# Altium schematic sheet Microcontroller.SchDoc: Microcontroller
size A3; DocumentNumber: 13; SheetNumber: 13; SheetTotal: 19
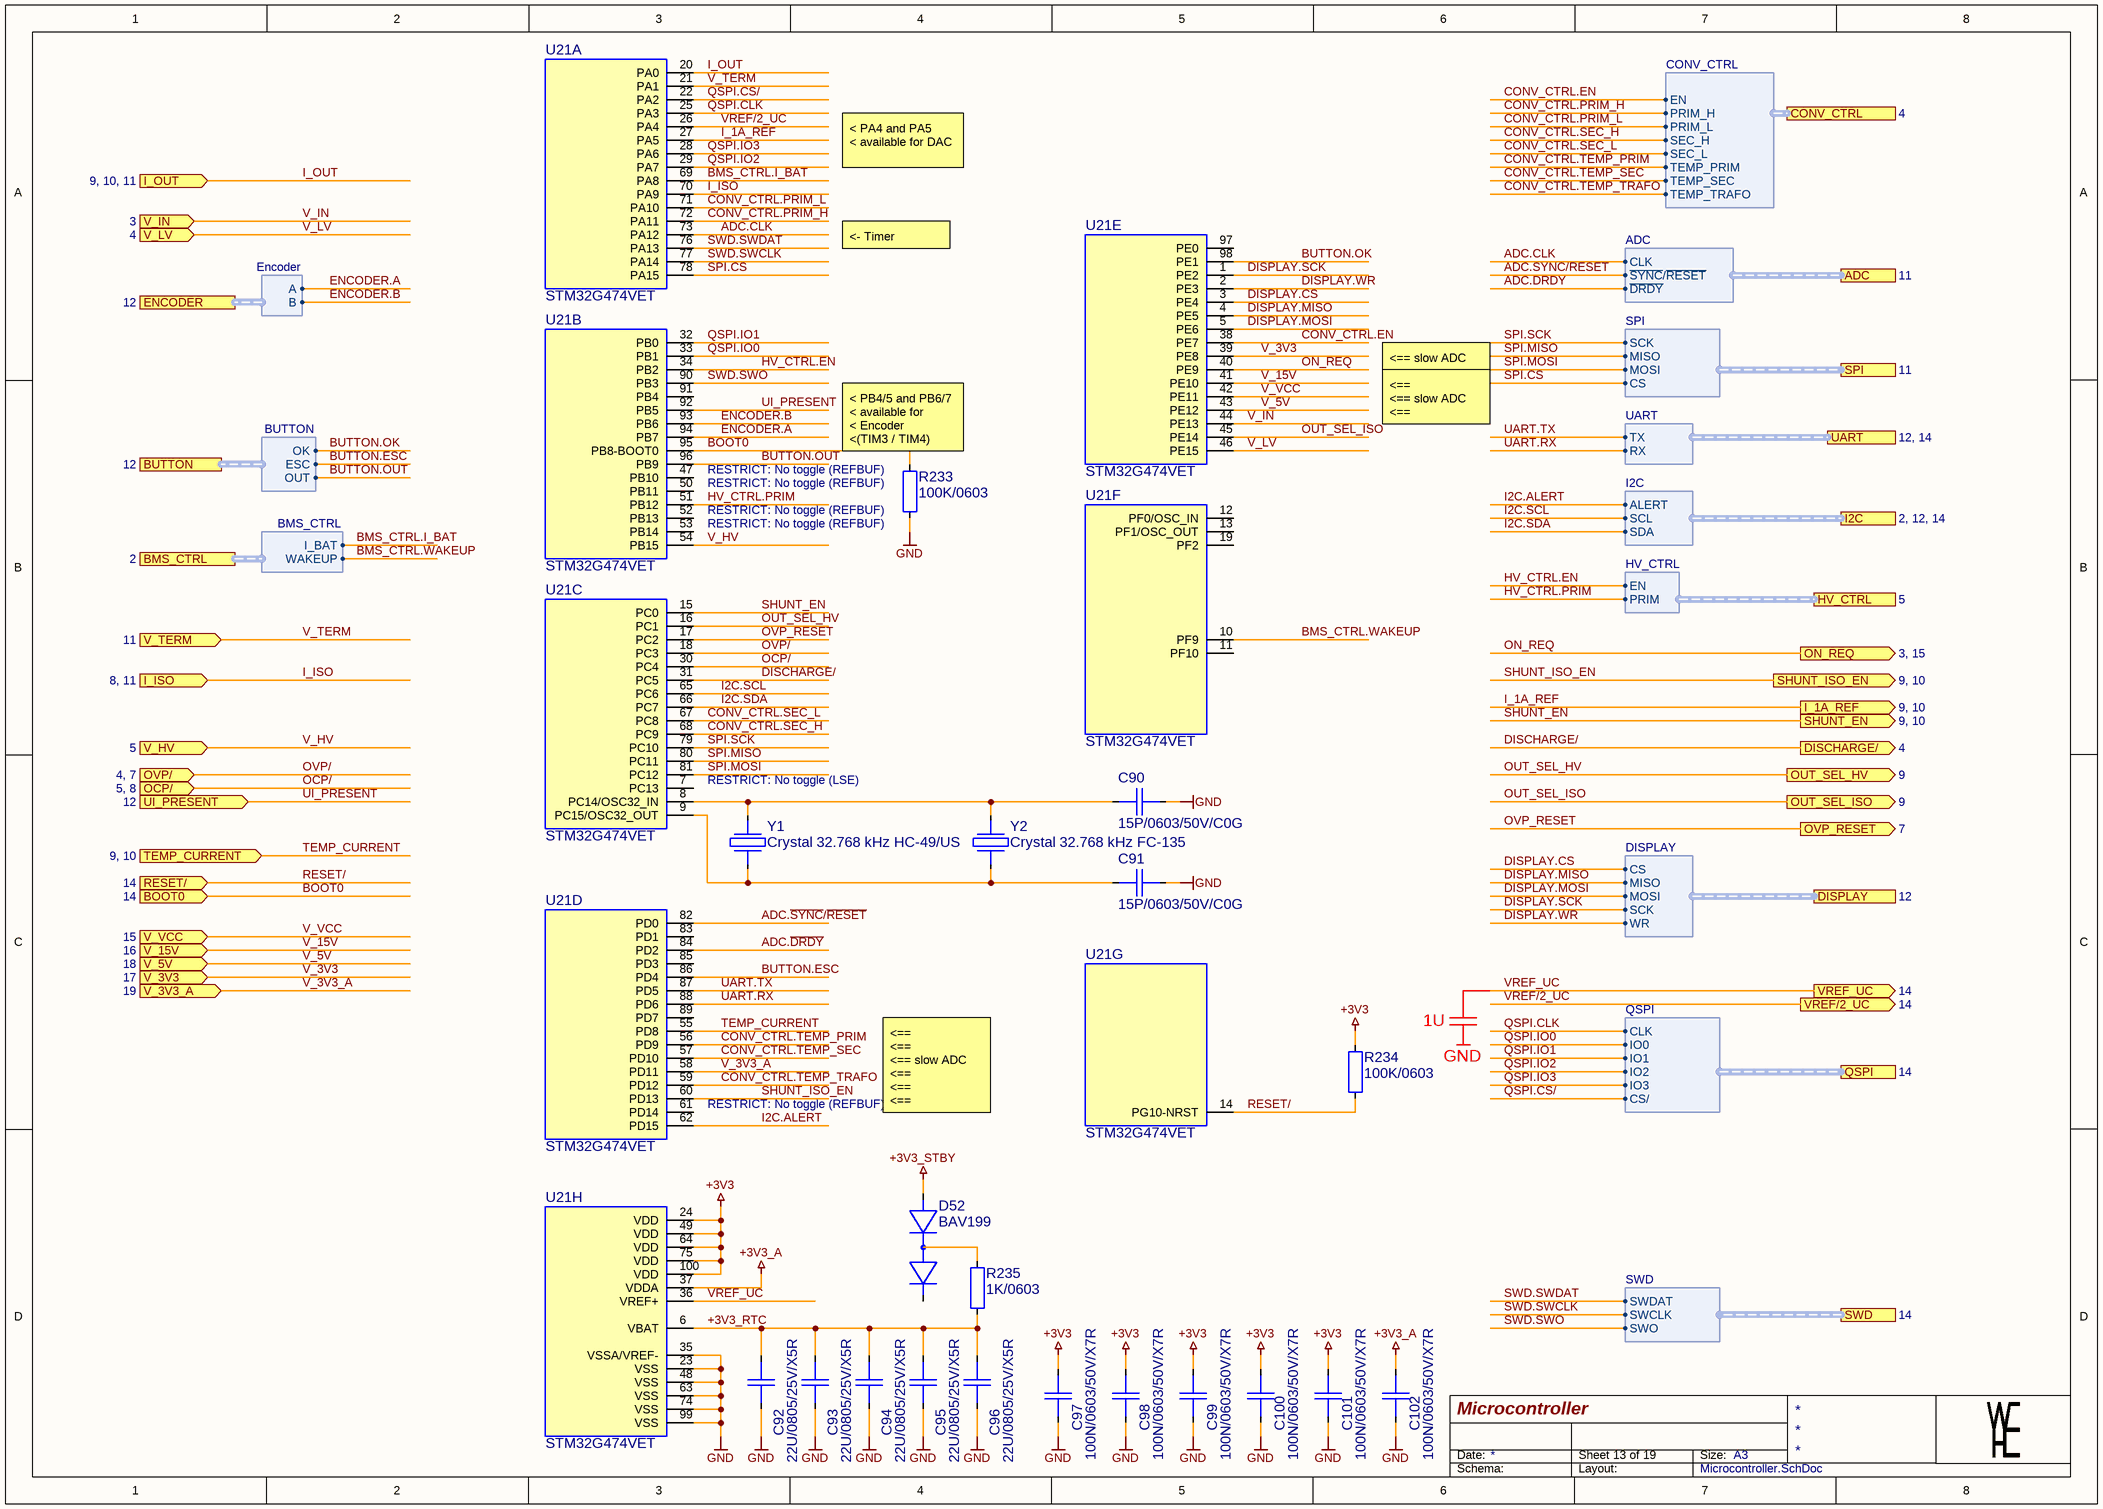
[diagram p0: Microcontroller.SchDoc]

## Parts
C90  15P/0603/50V/C0G  [CAP0603_C0G]
C91  15P/0603/50V/C0G  [CAP0603_C0G]
C92  22U/0805/25V/X5R  [CAP0805_X7R]
C93  22U/0805/25V/X5R  [CAP0805_X7R]
C94  22U/0805/25V/X5R  [CAP0805_X7R]
C95  22U/0805/25V/X5R  [CAP0805_X7R]
C96  22U/0805/25V/X5R  [CAP0805_X7R]
C97  100N/0603/50V/X7R  [CAP0603_X7R]
C98  100N/0603/50V/X7R  [CAP0603_X7R]
C99  100N/0603/50V/X7R  [CAP0603_X7R]
C100  100N/0603/50V/X7R  [CAP0603_X7R]
C101  100N/0603/50V/X7R  [CAP0603_X7R]
C102  100N/0603/50V/X7R  [CAP0603_X7R]
D52  BAV199  [SOT2395P280X125-3-SE]
R233  100K/0603  [R0603-0.40-WW]
R234  100K/0603  [R0603-0.40-WW]
R235  1K/0603  [R0603-0.40-WW]
U21  STM32G474VET  [QFP050P1600X1600X160-100]  (parts A,B,C,D,E,F,G,H of 8)
Y1  Crystal 32.768 kHz HC-49/US  [CYSMD275P760X320C230]
Y2  Crystal 32.768 kHz FC-135  [CYSMD250P320X150X090]

## Ports
ADC (harness ADC, see 11), BMS_CTRL (harness BMS_CTRL, see 2), BOOT0 (in, see 14), BUTTON (harness BUTTON, see 12), CONV_CTRL (harness CONV_CTRL, see 4), DISCHARGE/ (out, see 4), DISPLAY (harness DISPLAY, see 12), ENCODER (harness Encoder, see 12), HV_CTRL (harness HV_CTRL, see 5), I2C (harness I2C, see 2, 12, 14), I_1A_REF (out, see 9, 10), I_ISO (in, see 8, 11), I_OUT (in, see 9, 10, 11), OCP/ (in, see 5, 8), ON_REQ (out, see 3, 15), OUT_SEL_HV (out, see 9), OUT_SEL_ISO (out, see 9), OVP/ (in, see 4, 7), OVP_RESET (out, see 7), QSPI (harness QSPI, see 14), RESET/ (in, see 14), SHUNT_EN (out, see 9, 10), SHUNT_ISO_EN (out, see 9, 10), SPI (harness SPI, see 11), SWD (harness SWD, see 14), TEMP_CURRENT (in, see 9, 10), UART (harness UART, see 12, 14), UI_PRESENT (in, see 12), V_3V3 (in, see 17), V_3V3_A (in, see 19), V_5V (in, see 18), V_15V (in, see 16), V_HV (in, see 5), V_IN (in, see 3), V_LV (in, see 4), V_TERM (in, see 11), V_VCC (in, see 15), VREF/2_UC (out, see 14), VREF_UC (out, see 14)

## Harnesses
CONV_CTRL: EN, PRIM_H, SEC_H, TEMP_PRIM, TEMP_SEC, TEMP_TRAFO, PRIM_L, SEC_L
I2C: ALERT, SCL, SDA
BUTTON: ESC, OK, OUT
Encoder: A, B
ADC: CLK, ~{SYNC}/~{RESET}, ~{DRDY}
SPI: SCK, MISO, MOSI, CS
UART: TX, RX
BMS_CTRL: I_BAT, WAKEUP
HV_CTRL: EN, PRIM
DISPLAY: CS, MISO, MOSI, SCK, WR
QSPI: CLK, IO0, CS/, IO1, IO2, IO3
SWD: SWDAT, SWCLK, SWO

## Nets
+3V3: C97.1 C98.1 C99.1 C100.1 C101.1 R234.1 U21.24(VDD) U21.49(VDD) U21.64(VDD) U21.75(VDD) U21.100(VDD)
+3V3_A: C102.1 U21.37(VDDA)
+3V3_STBY: D52.1(A1)
GND: C90.2 C91.2 C92.2 C93.2 C94.2 C95.2 C96.2 C97.2 C98.2 C99.2 C100.2 C101.2 C102.2 R233.2 U21.23(VSS) U21.35(VSSA/VREF-) U21.48(VSS) U21.63(VSS) U21.74(VSS) U21.99(VSS)
+3V3_RTC: C92.1 C93.1 C94.1 C95.1 C96.1 R235.2 U21.6(VBAT)
ADC.CLK: U21.73(PA12) ; port ADC.CLK
ADC.~{DRDY}: U21.84(PD2) ; port ADC.~{DRDY}
ADC.~{SYNC}/~{RESET}: U21.82(PD0) ; port ADC.~{SYNC}/~{RESET}
BMS_CTRL.I_BAT: U21.69(PA8) ; port BMS_CTRL.I_BAT
BMS_CTRL.WAKEUP: U21.10(PF9) ; port BMS_CTRL.WAKEUP
BOOT0: R233.1 U21.95(PB8-BOOT0) ; port BOOT0
BUTTON.ESC: U21.86(PD4) ; port BUTTON.ESC
BUTTON.OK: U21.98(PE1) ; port BUTTON.OK
BUTTON.OUT: U21.96(PB9) ; port BUTTON.OUT
CONV_CTRL.EN: U21.38(PE7) ; port CONV_CTRL.EN
CONV_CTRL.PRIM_H: U21.72(PA11) ; port CONV_CTRL.PRIM_H
CONV_CTRL.PRIM_L: U21.71(PA10) ; port CONV_CTRL.PRIM_L
CONV_CTRL.SEC_H: U21.68(PC9) ; port CONV_CTRL.SEC_H
CONV_CTRL.SEC_L: U21.67(PC8) ; port CONV_CTRL.SEC_L
CONV_CTRL.TEMP_PRIM: U21.56(PD9) ; port CONV_CTRL.TEMP_PRIM
CONV_CTRL.TEMP_SEC: U21.57(PD10) ; port CONV_CTRL.TEMP_SEC
CONV_CTRL.TEMP_TRAFO: U21.59(PD12) ; port CONV_CTRL.TEMP_TRAFO
DISCHARGE/: U21.31(PC5) ; port DISCHARGE/
DISPLAY.CS: U21.3(PE4) ; port DISPLAY.CS
DISPLAY.MISO: U21.4(PE5) ; port DISPLAY.MISO
DISPLAY.MOSI: U21.5(PE6) ; port DISPLAY.MOSI
DISPLAY.SCK: U21.1(PE2) ; port DISPLAY.SCK
DISPLAY.WR: U21.2(PE3) ; port DISPLAY.WR
ENCODER.A: U21.94(PB7) ; port ENCODER.A
ENCODER.B: U21.93(PB6) ; port ENCODER.B
HV_CTRL.EN: U21.34(PB2) ; port HV_CTRL.EN
HV_CTRL.PRIM: U21.51(PB12) ; port HV_CTRL.PRIM
I2C.ALERT: U21.62(PD15) ; port I2C.ALERT
I2C.SCL: U21.65(PC6) ; port I2C.SCL
I2C.SDA: U21.66(PC7) ; port I2C.SDA
I_1A_REF: U21.27(PA5) ; port I_1A_REF
I_ISO: U21.70(PA9) ; port I_ISO
I_OUT: U21.20(PA0) ; port I_OUT
OCP/: U21.30(PC4) ; port OCP/
ON_REQ: U21.40(PE9) ; port ON_REQ
OUT_SEL_HV: U21.16(PC1) ; port OUT_SEL_HV
OUT_SEL_ISO: U21.45(PE14) ; port OUT_SEL_ISO
OVP/: U21.18(PC3) ; port OVP/
OVP_RESET: U21.17(PC2) ; port OVP_RESET
QSPI.CLK: U21.25(PA3) ; port QSPI.CLK
QSPI.CS/: U21.22(PA2) ; port QSPI.CS/
QSPI.IO0: U21.33(PB1) ; port QSPI.IO0
QSPI.IO1: U21.32(PB0) ; port QSPI.IO1
QSPI.IO2: U21.29(PA7) ; port QSPI.IO2
QSPI.IO3: U21.28(PA6) ; port QSPI.IO3
RESET/: R234.2 U21.14(PG10-NRST) ; port RESET/
SHUNT_EN: U21.15(PC0) ; port SHUNT_EN
SHUNT_ISO_EN: U21.60(PD13) ; port SHUNT_ISO_EN
SPI.CS: U21.78(PA15) ; port SPI.CS
SPI.MISO: U21.80(PC11) ; port SPI.MISO
SPI.MOSI: U21.81(PC12) ; port SPI.MOSI
SPI.SCK: U21.79(PC10) ; port SPI.SCK
SWD.SWCLK: U21.77(PA14) ; port SWD.SWCLK
SWD.SWDAT: U21.76(PA13) ; port SWD.SWDAT
SWD.SWO: U21.90(PB3) ; port SWD.SWO
TEMP_CURRENT: U21.55(PD8) ; port TEMP_CURRENT
UART.RX: U21.88(PD6) ; port UART.RX
UART.TX: U21.87(PD5) ; port UART.TX
UI_PRESENT: U21.92(PB5) ; port UI_PRESENT
V_3V3: U21.39(PE8) ; port V_3V3
V_3V3_A: U21.58(PD11) ; port V_3V3_A
V_5V: U21.43(PE12) ; port V_5V
V_15V: U21.41(PE10) ; port V_15V
V_HV: U21.54(PB15) ; port V_HV
V_IN: U21.44(PE13) ; port V_IN
V_LV: U21.46(PE15) ; port V_LV
V_TERM: U21.21(PA1) ; port V_TERM
V_VCC: U21.42(PE11) ; port V_VCC
VREF/2_UC: U21.26(PA4) ; port VREF/2_UC
VREF_UC: U21.36(VREF+) ; port VREF_UC
NetC90_1: C90.1 U21.8(PC14/OSC32_IN) Y1.1 Y2.1
NetC91_1: C91.1 U21.9(PC15/OSC32_OUT) Y1.2 Y2.2
NetD52_3: D52.3(K1/A2) R235.1

Not connected (* = marked no-connect by the designer): D52 2(K2); U21 7(PC13) 11(PF10) 12(PF0/OSC_IN) 13(PF1/OSC_OUT) 19(PF2) 47(PB10) 50(PB11) 52(PB13) 53(PB14) 61(PD14) 83(PD1) 85(PD3) 89(PD7) 91(PB4) 97(PE0)

## Notes on the sheet
- < PA4 and PA5
  < available for DAC
- <- Timer
- <== slow ADC
- (near R233) < PB4/5 and PB6/7
  < available for
  < Encoder
  <(TIM3 / TIM4)
- <==
  <== slow ADC
  <==
- RESTRICT: No toggle (REFBUF)
- RESTRICT: No toggle (LSE)
- Chose between crystals depending on available space on PCB
- 1U
- GND
- (near U21) RESTRICT: No toggle (REFBUF)
- <==
  <==
  <== slow ADC
  <==
  <==
  <==
- Date:
- Size:
- A3
- Schema:
- Layout:

## Library data of the parts
C90 C91 = 15P/0603/50V/C0G: CAP SM 0603 15pF 50V C0G; Manufacturer: GENERIC; Manufacturer 1: YAGEO; Manufacturer Part Number 1: CC0603JRNPO9BN150; Absolute Value: 1.5E-11; Eurocircuits GPN: GPC0603150-C0G; Part Number: 15P/0603/50V/C0G; Package: 0603; Value: 15pF; HelpURL: https://www.yageo.com/upload/media/product/productsearch/datasheet/mlcc/UPY-GP_NP0_16V-to-50V_18.pdf; Supplier 1: Digi-Key; Supplier Part Number 1: 311-1060-1-ND; Manufacturer 2: YAGEO; Manufacturer Part Number 2: CC0603KRNPO9BN150; Supplier 2: Digi-Key; Supplier Part Number 2: 311-4028-1-ND; JLC Type: Basic; Manufacturer Part Number 3: Samsung Electro-Mechanics; Supplier 3: LCSC; Supplier Part Number 3: C1644
C92-C96 = 22U/0805/25V/X5R: CAP SM 0805 22uF 25V X5R; Manufacturer: GENERIC; Manufacturer 1: Samsung Electro-Mechanics; Manufacturer Part Number 1: CL21A226MAYNNNE; Absolute Value: 2.2E-5; Eurocircuits GPN: GPN0805106-25; Part Number: 22U/0805/25V/X5R; Package: 0805; Value: 22uF; HelpURL: https://mm.digikey.com/Volume0/opasdata/d220001/medias/docus/339/CL21A226MAYNNNE_Spec.pdf; Supplier 1: Digi-Key; Supplier Part Number 1: 1276-CL21A226MAYNNNECT-ND; Manufacturer Part Number 3: CL21A226MAQNNNE; Supplier 3: LCSC; Supplier Part Number 3: C45783; JLC Type: Basic
C97-C102 = 100N/0603/50V/X7R: CAP SM 0603 100nF 50V X7R; Manufacturer: GENERIC; Manufacturer 1: YAGEO; Manufacturer Part Number 1: CC0603KPX7R9BB104; Absolute Value: 1E-7; Eurocircuits GPN: GPC0603104; Part Number: 100N/0603/50V/X7R; Package: 0603; Value: 100nF; HelpURL: https://www.yageo.com/upload/media/product/app/datasheet/mlcc/upy-gphc_x7r_6_3v-to-250v.pdf; Supplier 1: Digi-Key; Supplier Part Number 1: 311-3567-1-ND; Supplier 3: LCSC; Supplier Part Number 3: C14663; Manufacturer 2: YAGEO; Manufacturer Part Number 2: CC0603MRX7R9BB104; Supplier 2: Digi-Key; Supplier Part Number 2: 311-4110-1-ND; JLC Type: Basic; Manufacturer Part Number 3: CC0603KRX7R9BB104
D52 = BAV199: Silicon Low Leakage Diode 85V; Manufacturer: Infineon Technologies; Manufacturer Part Number 1: BAV199E6433HTMA1; Part Number: BAV199; Package: SOT23; Value: BAV199; Absolute Value: 85V; HelpURL: https://www.infineon.com/dgdl/bav199series.pdf?folderId=db3a30431400ef6801141c748874044e&fileId=db3a30431400ef6801141cba733104e5; Manufacturer 1: Infineon Technologies; Supplier 1: Digikey; Supplier Part Number 1: BAV199E6433HTMA1CT-ND; Manufacturer 3: LRC; Manufacturer Part Number 3: LBAV199LT1G; Supplier 3: LCSC; Supplier Part Number 3: C12740
R233 R234 = 100K/0603: RES SM 0603 100K; Manufacturer: GENERIC; Manufacturer 1: YAGEO; Manufacturer Part Number 1: RC0603FR-13100KL; Absolute Value: 100000; Eurocircuits GPN: GPR0603100K; Part Number: 100K/0603; Package: 0603; Value: 100K; HelpURL: https://www.yageogroup.com/content/datasheet/asset/file/PYU-RC_GROUP_51_ROHS_L; Supplier 1: Digi-Key; Supplier Part Number 1: 13-RC0603FR-13100KLCT-ND; Manufacturer 2: YAGEO; Manufacturer Part Number 2: RC0603FR-10100KL; Supplier 2: Digi-Key; Supplier Part Number 2: 13-RC0603FR-10100KLCT-ND; Manufacturer 3: UNI-ROYAL(Uniroyal Elec); Manufacturer Part Number 3: 0603WAF1003T5E; Supplier 3: LCSC; Supplier Part Number 3: C25803; JLC Type: Basic
R235 = 1K/0603: RES SM 0603 1K; Manufacturer: GENERIC; Manufacturer 1: YAGEO; Manufacturer Part Number 1: RC0603FR-131KL; Absolute Value: 1000; Eurocircuits GPN: GPR06031K; Part Number: 1K/0603; Package: 0603; Value: 1K; HelpURL: https://www.yageogroup.com/content/datasheet/asset/file/PYU-RC_GROUP_51_ROHS_L; Supplier 1: Digi-Key; Supplier Part Number 1: 13-RC0603FR-131KLCT-ND; Manufacturer 2: YAGEO; Manufacturer Part Number 2: RC0603FR-101KL; Supplier 2: Digi-Key; Supplier Part Number 2: 13-RC0603FR-101KLCT-ND; Manufacturer 3: UNI-ROYAL(Uniroyal Elec); Manufacturer Part Number 3: 0603WAF1001T5E; Supplier 3: LCSC; Supplier Part Number 3: C21190; JLC Type: Basic
U21 = STM32G474VET: STM32G474VET, Arm® Cortex®-M4 32-bit MCU+FPU, 170 MHz / 213 DMIPS, 512 kB flash, 128 KB SRAM, rich analog, math acc, 184 ps 12 chan Hi-res timer, QFP-100; Manufacturer: ST Microelectronics; Manufacturer 1: STMicroelectronics; Manufacturer Part Number 1: STM32G474VET6; Part Number: STM32G474VET; Package: QFP-100; HelpURL: https://www.st.com/resource/en/datasheet/stm32g474ve.pdf; Supplier 1: Digi-Key; Supplier Part Number 1: 497-19476-ND; Manufacturer 2: STMicroelectronics; Manufacturer Part Number 2: STM32G474VET3; Supplier 2: Digi-Key; Supplier Part Number 2: 497-STM32G474VET3-ND; Manufacturer 3: STMicroelectronics; Manufacturer Part Number 3: STM32G474VET6TR; Supplier 3: LCSC; Supplier Part Number 3: C1857438; JLC Type: Extended
Y1 = Crystal 32.768 kHz HC-49/US: 32.768 kHz ±20ppm Crystal 12,5pF HC-49/US; Manufacturer: CJKJ; Part Number: Crystal 32.768 kHz HC-49/US; Package: HC-49/US; HelpURL: https://www.lcsc.com/datasheet/C1122370.pdf; Manufacturer 3: CJKJ; Manufacturer Part Number 3: C30732.768N12.5M20; Supplier 3: LCSC; Supplier Part Number 3: C1122370; JLC Type: Extended
Y2 = Crystal 32.768 kHz FC-135: 32.768 kHz ±20ppm Crystal 12,5pF FC-135; Manufacturer: Epson; Manufacturer Part Number 1: FC-135 32.7680KA-A5; Part Number: Crystal 32.768 kHz FC-135; Package: FC-135; HelpURL: https://support.epson.biz/td/api/doc_check.php?dl=brief_FC-135; Manufacturer 1: EPSON; Supplier 1: Digi-Key; Supplier Part Number 1: SER4103CT-ND; Manufacturer 3: EPSON; Manufacturer Part Number 3: Q13FC13500004; Supplier 3: LCSC; Supplier Part Number 3: C32346; JLC Type: Basic